# EAGLE design Stepper Driver (EAGLE 9.6.1)
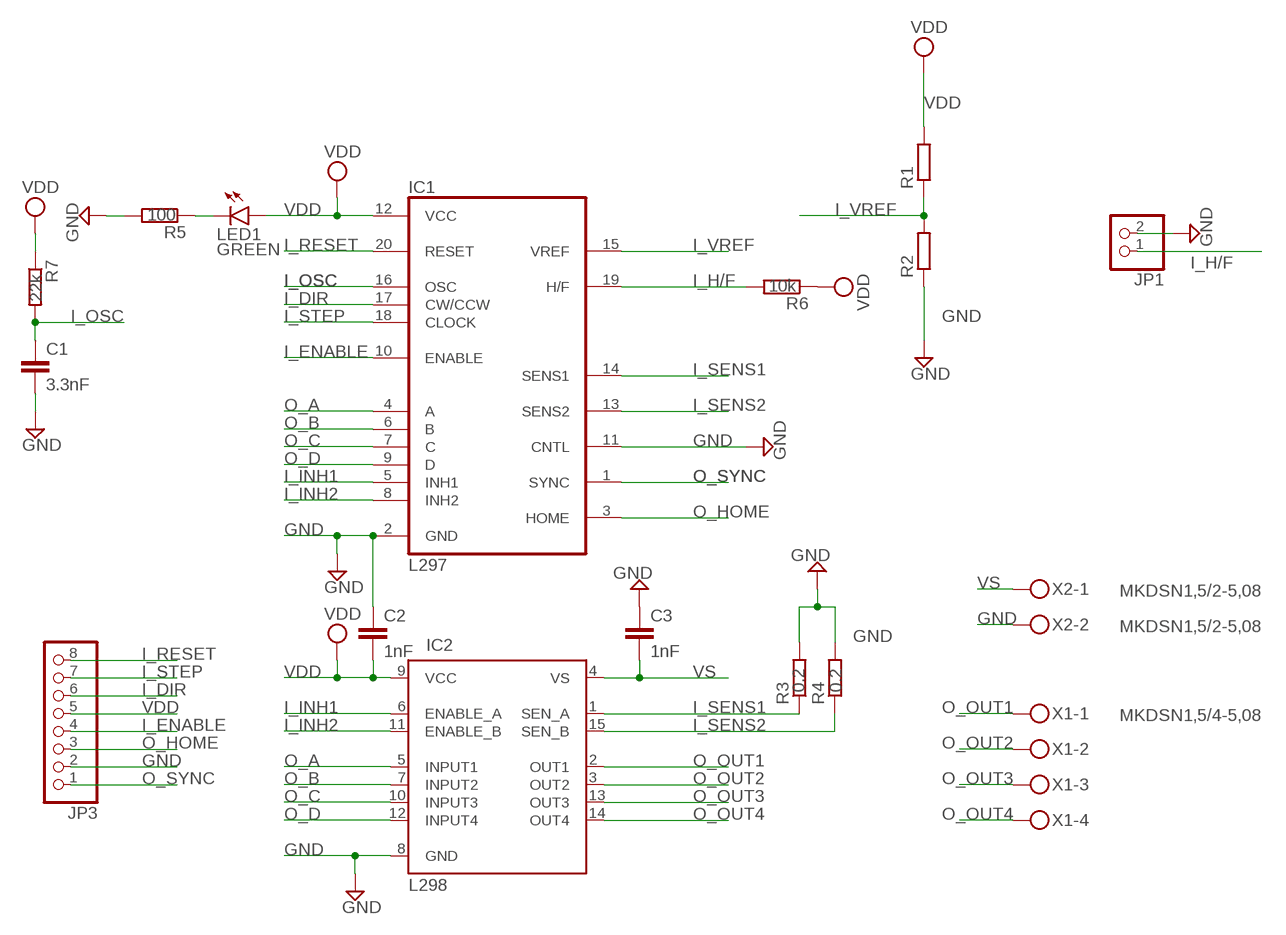
[diagram p0: schematic, sheet 1]

## Parts
C1  3.3nF  C-EUC0805K  [C0805K]
C2  1nF  C-EUC0805K  [C0805K]
C3  1nF  C-EUC0805K  [C0805K]
IC1  L297  [DIL20]
IC2  L298  [MULTIWATT-15]
JP1  PINHD-1X2  [1X02]
JP3  PINHD-1X8  [1X08]
LED1  GREEN  LED5MM  [LED5MM]
R1  R-EU_R0805  [R0805]
R2  R-EU_R0805  [R0805]
R3  0.2  R-EU_R2512  [R2512]
R4  0.2  R-EU_R2512  [R2512]
R5  100  R-EU_R0805  [R0805]
R6  10k  R-EU_R0805  [R0805]
R7  22k  R-EU_R0805  [R0805]
X1  MKDSN1,5/4-5,08  [MKDSN1,5/4-5,08]
X2  MKDSN1,5/2-5,08  [MKDSN1,5/2-5,08]

## Nets
GND: C1.2 C2.1 C3.1 IC1.2(GND) IC1.11(CNTL) IC2.8(GND) JP1.2 JP3.2 R2.1 R3.2 R4.2 R5.2 X2.2
I_DIR: IC1.17(CW/CCW) JP3.6
I_ENABLE: IC1.10(ENABLE) JP3.4
I_H/F: IC1.19(H/F) JP1.1 R6.2
I_INH1: IC1.5(INH1) IC2.6(ENABLE_A)
I_INH2: IC1.8(INH2) IC2.11(ENABLE_B)
I_OSC: C1.1 IC1.16(OSC) R7.2
I_RESET: IC1.20(RESET) JP3.8
I_SENS1: IC1.14(SENS1) IC2.1(SEN_A) R3.1
I_SENS2: IC1.13(SENS2) IC2.15(SEN_B) R4.1
I_STEP: IC1.18(CLOCK) JP3.7
I_VREF: IC1.15(VREF) R1.1 R2.2
N$1: LED1.K(C) R5.1
O_A: IC1.4(A) IC2.5(INPUT1)
O_B: IC1.6(B) IC2.7(INPUT2)
O_C: IC1.7(C) IC2.10(INPUT3)
O_D: IC1.9(D) IC2.12(INPUT4)
O_HOME: IC1.3(HOME) JP3.3
O_OUT1: IC2.2(OUT1) X1.1
O_OUT2: IC2.3(OUT2) X1.2
O_OUT3: IC2.13(OUT3) X1.3
O_OUT4: IC2.14(OUT4) X1.4
O_SYNC: IC1.1(SYNC) JP3.1
VDD: C2.2 IC1.12(VCC) IC2.9(VCC) JP3.5 LED1.A R1.2 R6.1 R7.1
VS: C3.2 IC2.4(VS) X2.1

## Library data of the parts
C1-C3 = rcl:C-EU: CAPACITOR, European symbol; SPICEPREFIX: C
IC1 = st-microelectronics:L297: STEPPER MOTOR CONTROLLER; MPN: L297/1; OC_FARNELL: 1094209; OC_NEWARK: 56P8258
IC2 = st-microelectronics:L298: DUAL FULL-BRIDGE DRIVER; MPN: L298N; OC_FARNELL: 1589425; OC_NEWARK: 32M1527
JP1 = pinhead:PINHD-1X2: PIN HEADER
JP3 = pinhead:PINHD-1X8: PIN HEADER
LED1 = led:LED: LED OSRAM: - CHIPLED LG R971, LG N971, LY N971, LG Q971, LY Q971, LO R971, LY R971 LH N974, LH R974 LS Q976, LO Q976, LY Q976 LO Q996 - Hyper CHIPLED LW Q18S LB Q993, LB Q99A, LB R99A - SideLED LS A670, LO A670, LY A670, LG A670, LP A670 LB A673, LV A673, LT A673, LW A673 LH A674 LY A675 LS A676, LA A676, LO A676, LY A676, LW A676 LS A679, LY A679, LG A679 - Hyper Micro SIDELED® LS Y876, LA Y876, LO Y876, LY Y876 LT Y87S - SmartLED LW L88C, LW L88S LB L89C, LB L89S, LG L890 LS L89K, LO L89K, LY L89K LS L896, LA L896, LO L896, LY L896 - TOPLED LS T670, LO T670, LY T670, LG T670, LP T670 LSG T670, LSP T670, LSY T670, LOP T670, LYG T670 LG T671, LOG T671, LSG T671 LB T673, LV T673, LT T673, LW T673 LH T674 LS T676, LA T676, LO T676, LY T676, LB T676, LH T676, LSB T676, LW T676 LB T67C, LV T67C, LT T67C, LS T67K, LO T67K, LY T67K, LW E67C LS E67B, LA E67B, LO E67B, LY E67B, LB E67C, LV E67C, LT E67C LW T67C LS T679, LY T679, LG T679 LS T770, LO T770, LY T770, LG T770, LP T770 LB T773, LV T773, LT T773, LW T773 LH T774 LS E675, LA E675, LY E675, LS T675 LS T776, LA T776, LO T776, LY T776, LB T776 LHGB T686 LT T68C, LB T68C - Hyper Mini TOPLED® LB M676 - Mini TOPLED Santana® LG M470 LS M47K, LO M47K, LY M47K Source: http://www.osram.convergy.de LUXEON: - LUMILED® LXK2-PW12-R00, LXK2-PW12-S00, LXK2-PW14-U00, LXK2-PW14-V00 LXK2-PM12-R00, LXK2-PM12-S00, LXK2-PM14-U00 LXK2-PE12-Q00, LXK2-PE12-R00, LXK2-PE12-S00, LXK2-PE14-T00, LXK2-PE14-U00 LXK2-PB12-K00, LXK2-PB12-L00, LXK2-PB12-M00, LXK2-PB14-N00, LXK2-PB14-P00, LXK2-PB14-Q00 LXK2-PR12-L00, LXK2-PR12-M00, LXK2-PR14-Q00, LXK2-PR14-R00 LXK2-PD12-Q00, LXK2-PD12-R00, LXK2-PD12-S00 LXK2-PH12-R00, LXK2-PH12-S00 LXK2-PL12-P00, LXK2-PL12-Q00, LXK2-PL12-R00 Source: www.luxeon.com KINGBRIGHT: KA-3528ASYC Source: www.kingbright.com
R1-R7 = rcl:R-EU_: RESISTOR, European symbol; SPICEPREFIX: R
X1 = con-phoenix-508:MKDSN1,5/4-5,08: MKDSN 1,5/ 4-5,08 Printklemme Nennstrom: 13,5 A Nennspannung: 250 V Rastermaß: 5,08 mm Polzahl: 4 Anschlussart: Schraubanschluss Montage: Löten Anschlussrichtung Leiter/Platine: 0 ° Artikelnummer: 1729144 Source: http://eshop.phoenixcontact.com .. 1729144.pdf
X2 = con-phoenix-508:MKDSN1,5/2-5,08: MKDSN 1,5/ 2-5,08 Printklemme Nennstrom: 13,5 A Nennspannung: 250 V Rastermaß: 5,08 mm Polzahl: 2 Anschlussart: Schraubanschluss Montage: Löten Anschlussrichtung Leiter/Platine: 0 ° Artikelnummer: 1729128 Source: http://eshop.phoenixcontact.com .. 1729128.pdf

## Board
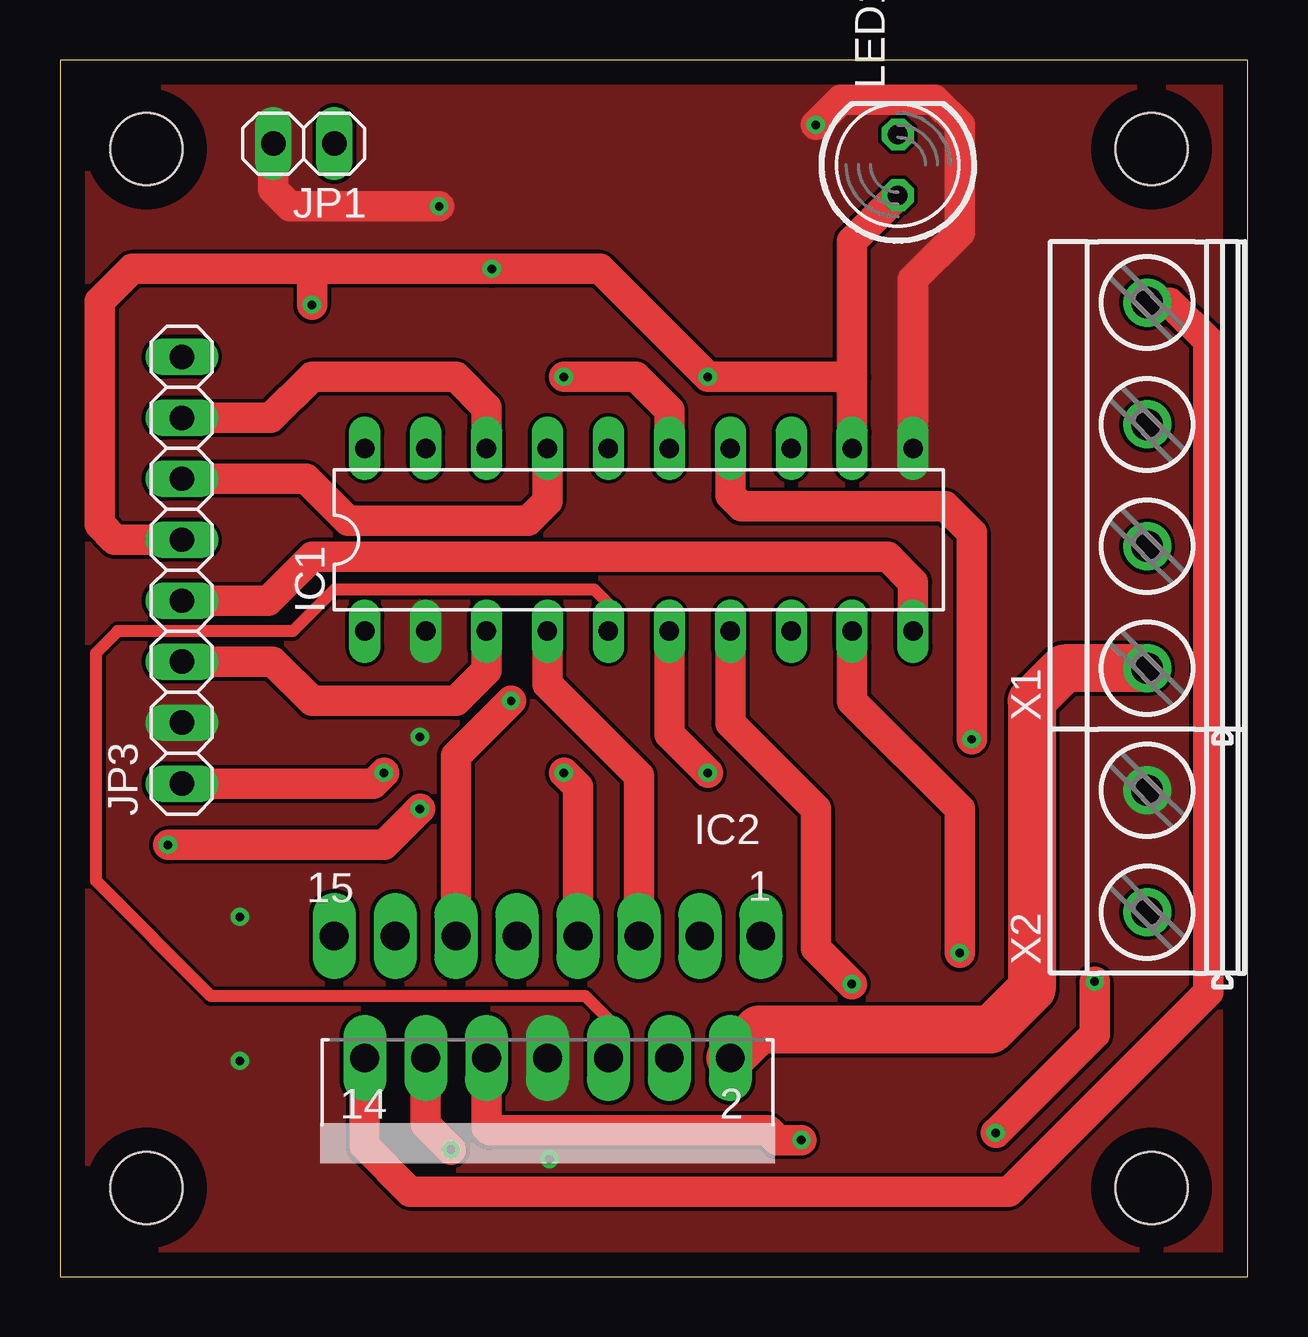
[diagram p1: board, top side]
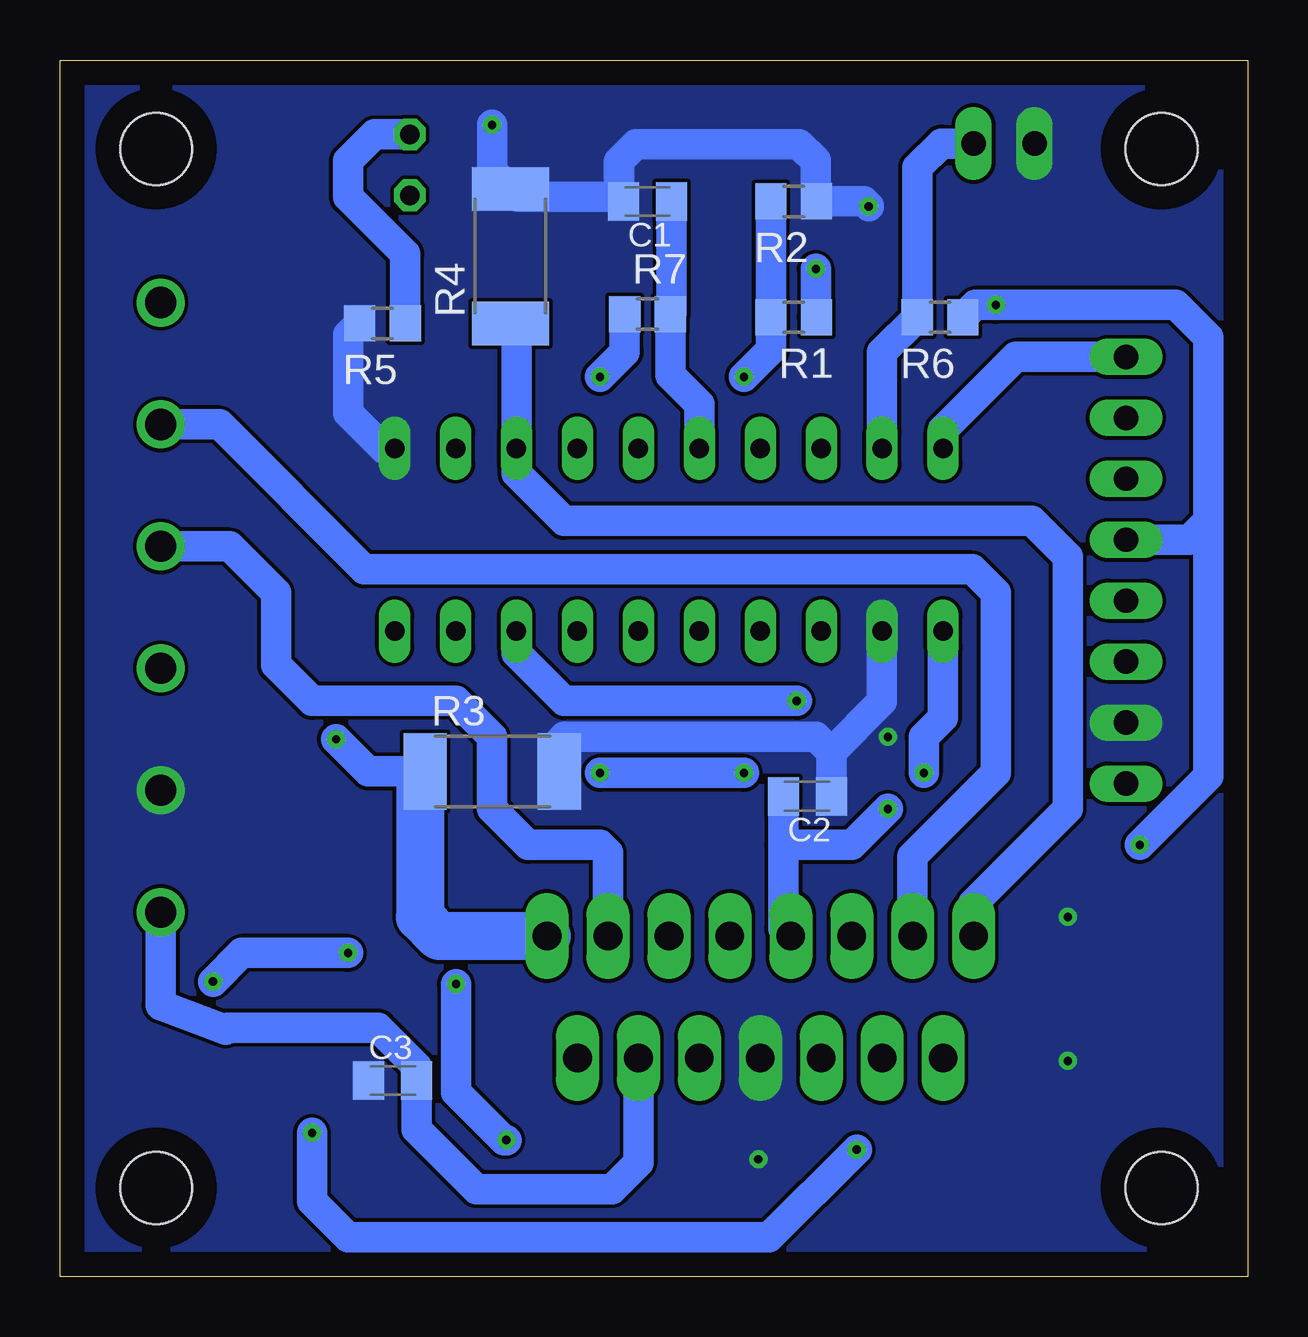
[diagram p2: board, bottom side, seen from below]

Size 49.51 x 50.7 mm. Coordinates in mm from the lower left corner, seen from the top.
Outline: 0,0 49.51,0 49.51,50.7 0,50.7 0,0
Copper layers (1*16): Top 0.035mm / dielectric 1.5mm / Bottom 0.035mm
Design rules "default": minimum track width 6mil, minimum drill 0.35mm, track to track 6mil, track to pad 6mil, pad to pad 6mil, via to via 6mil, smd to smd 6mil, copper to edge 40mil, drill to drill 6mil, minimum pad ring 10mil, minimum via ring 8mil, stop-mask expansion 4mil, vias tented up to drill 0mil, thermal gap 10mil
Holes 3 mm at 3.6,47 3.6,3.7 45.5,3.7 45.5,47

### Footprints (pad centres in the part's own frame; a part is rotated, then mirrored left to right if it is on the bottom)
C0805K = smd 1.3 x 1.6: 1 -1,0; 2 1,0
DIL20 = drill 0.813 long: 1 -11.43,-3.81; 2 -8.89,-3.81; 3 -6.35,-3.81; 4 -3.81,-3.81; 5 -1.27,-3.81; 6 1.27,-3.81; 7 3.81,-3.81; 8 6.35,-3.81; 9 8.89,-3.81; 10 11.43,-3.81; 11 11.43,3.81; 12 8.89,3.81; 13 6.35,3.81; 14 3.81,3.81; 15 1.27,3.81; 16 -1.27,3.81; 17 -3.81,3.81; 18 -6.35,3.81; 19 -8.89,3.81; 20 -11.43,3.81
MULTIWATT-15 = drill 1.2 long: 1 -8.89,-7.62; 2 -7.62,-2.54; 3 -6.35,-7.62; 4 -5.08,-2.54; 5 -3.81,-7.62; 6 -2.54,-2.54; 7 -1.27,-7.62; 8 0,-2.54; 9 1.27,-7.62; 10 2.54,-2.54; 11 3.81,-7.62; 12 5.08,-2.54; 13 6.35,-7.62; 14 7.62,-2.54; 15 8.89,-7.62
1X02 = drill 1.016 long: 1 -1.27,0; 2 1.27,0
1X08 = drill 1.016 long: 1 -8.89,0; 2 -6.35,0; 3 -3.81,0; 4 -1.27,0; 5 1.27,0; 6 3.81,0; 7 6.35,0; 8 8.89,0
LED5MM = drill 0.813 octagon: A -1.27,0; K 1.27,0
R0805 = smd 1.3 x 1.5: 1 -0.95,0; 2 0.95,0
R2512 = smd 1.8 x 3.2: 1 -2.8,0; 2 2.8,0
MKDSN1,5/4-5,08 = drill 1.3 pad 2: 1 -7.641,0.025; 2 -2.561,0.025; 3 2.519,0.025; 4 7.599,0.025
MKDSN1,5/2-5,08 = drill 1.3 pad 2: 1 -2.561,0.025; 2 2.519,0.025

### Placement (x,y rotation side)
C1  25.02,44.81 180 bottom
C2  18.36,20.02 180 bottom
C3  35.64,8.18 0 bottom
IC1  24.13,30.71 0 top
IC2  20.32,6.58 180 top
JP1  10.16,47.22 180 top
JP3  5.08,29.44 90 top
LED1  34.92,46.33 90 top
R1  18.92,39.98 0 bottom
R2  18.92,44.81 180 bottom
R3  31.5,21.06 0 bottom
R4  30.73,42.52 90 bottom
R5  36.07,39.73 180 bottom
R6  12.83,39.98 180 bottom
R7  25.02,40.11 0 bottom
X1  45.34,33 90 top
X2  45.34,17.76 90 top

### Tracks (layer width: path | path; a pad name or v marks a point on that pad's centre or on a via)
GND  (via drill 0.35)
  Top 1.27: JP1.2 8.89,45.31 9.6,44.6 v15.8,44.6 | IC1.11 35.56,41.56 37.5,43.5 37.5,48 36.45,49.05 32.55,49.05 v31.5,48
  Bottom 1.27: C1.2 26.21,45 | 26.21,45 30.41,45 R4.2 31.5,46.09 v31.5,48 | R5.2 37.5,39.24 37.5,36 36,34.5 35.58,34.5 IC1.11 | C2.1 17.36,21.86 | 17.36,21.86 18,22.5 28.5,22.5 28.7,22.3 R3.2 | 17.36,21.86 15.24,23.98 IC1.2 | v15.8,44.6 16.01,44.81 R2.1 18,44.83 18,46.5 18.7,47.2 25.5,47.2 26.21,46.49 26.21,45
  other vias: 15,22.5 7.5,15 7.5,9 20.4,4.9
  pour Bottom (no thermals): 0,51 49.5,51 49.5,0 0,0
  pour Top (no thermals): 0,51 49.5,51 49.5,0 0,0
I_DIR
  Top 1.27: IC1.17 20.32,32.32 19.5,31.5 12,31.5 10.25,33.25 JP3.6
I_ENABLE
  Top 1.27: JP3.4 8.67,28.17 10.5,30 34.5,30 35.56,28.94 IC1.10
I_H/F
  Bottom 1.27: IC1.19 15.24,38.52 R6.2 13.78,46.22 12.78,47.22 JP1.1
I_INH1
  Top 0.508: IC2.6 22.86,10.74 21.9,11.7 6.3,11.7 1.5,16.5 1.5,26 2.4,26.9 9.7,26.9 11.43,28.63 22.27,28.63 22.86,28.04 IC1.5
I_INH2  (via drill 0.35)
  Top 1.27: v18.8,24 16.51,21.71 IC2.11
  Bottom 1.27: v18.8,24 28.5,24 30.48,25.98 IC1.8
I_OSC
  Bottom 1.27: C1.1 24.02,40.16 R7.2 24.07,37.57 22.86,36.36 IC1.16
I_RESET
  Bottom 1.27: JP3.8 9.67,38.33 12.7,35.3 IC1.20
I_SENS1  (via drill 0.35)
  Top 1.27: IC1.14 27.94,32.56 28.4,32.1 36.9,32.1 38,31 v38,22.4
  Bottom 0.305: R3.1 34.35,21 34.5,21
  Bottom 1.27: v38,22.4 36.66,21.06 R3.1
  Bottom 2: IC2.1 33.7,14.2 34.5,15 34.5,21
I_SENS2
  Bottom 1.27: R4.1 30.48,39.47 IC1.13 30.48,33.48 28.5,31.5 9,31.5 7.5,30 7.5,19.5 11.43,15.57 IC2.15
I_STEP
  Top 1.27: JP3.7 8.79,35.79 10.5,37.5 16.5,37.5 17.78,36.22 IC1.18
I_VREF  (via drill 0.35)
  Top 1.27: IC1.15 25.4,36.1 24,37.5 v21,37.5
  Bottom 1.27: R2.2 R1.1 19.87,38.63 v21,37.5
N$1
  Bottom 1.27: R5.1 35.12,42.62 37.5,45 37.5,46.5 36.4,47.6 LED1.K
O_A
  Top 1.27: IC2.5 24.13,20.87 20.32,24.68 IC1.4
O_B  (via drill 0.35)
  Top 1.27: IC2.7 21.59,20.41 v21,21 | v27,21 25.4,22.6 IC1.6
  Bottom 1.27: v21,21 v27,21
O_C  (via drill 0.35)
  Top 1.27: IC1.7 27.94,23.06 31.5,19.5 31.5,13.7 v33,12.2 | v30.9,5.7 29.9,5.7 29.5,6.1 17.9,6.1 17.78,6.22 IC2.10
  Bottom 1.27: v33,12.2 33,7.7 31,5.7 v30.9,5.7
O_D  (via drill 0.35)
  Top 1.27: IC1.9 33.02,23.98 37.5,19.5 v37.5,13.5 | IC2.12 15.24,6.36 v16.3,5.3 | v39,6 39.03,6 43.13,10.1 v43.13,12.3
  Bottom 1.27: v37.5,13.5 41.93,13.5 v43.13,12.3 | v16.3,5.3 19.95,1.65 37.5,1.65 39,3.15 v39,6
O_HOME
  Top 1.27: JP3.3 8.87,25.63 10.5,24 16.5,24 17.78,25.28 IC1.3
O_OUT1
  Top 2: X1.1 41.85,25.36 40.5,24 40.5,12 38.8,10.3 29.12,10.3 IC2.2
O_OUT2
  Bottom 1.27: IC2.3 26.67,17.67 27,18 30,18 31.5,19.5 31.5,22.5 33,24 39,24 40.5,25.5 40.5,28.5 42.44,30.43 X1.2
O_OUT3
  Bottom 1.27: IC2.13 13.97,17.53 10.5,21 10.5,28.5 11.48,29.48 36.83,29.48 42.86,35.52 X1.3
O_OUT4
  Top 1.27: IC2.14 12.7,5.45 14.6,3.55 39.55,3.55 47.86,11.86 47.86,39 46.26,40.59 X1.4
O_SYNC  (via drill 0.35)
  Top 1.27: JP3.1 13.05,20.55 v13.5,21
  Bottom 1.27: v13.5,21 13.5,22.5 12.7,23.3 IC1.1
VDD  (via drill 0.35)
  Top 1.27: LED1.A 33.02,43.16 33.02,37.5 | IC1.12 33.02,37.5 | 33.02,37.5 v27,37.5 22.5,42 v18,42 10.5,42 | 10.5,42 3,42 1.65,40.65 1.65,31.35 2.29,30.71 JP3.5 | 10.5,42 v10.5,40.5 | v15,19.5 13.5,18 v4.5,18
  Bottom 1.27: C2.2 19.36,18 | 19.36,18 19.36,14.51 IC2.9 | JP3.5 2.44,30.71 1.65,31.5 | R6.1 11.36,40.5 v10.5,40.5 3,40.5 1.65,39.15 1.65,31.5 | v27,37.5 25.97,38.53 R7.1 | v18,42 18,40.01 R1.2 | 19.36,18 16.5,18 v15,19.5 | v4.5,18 1.65,20.85 1.65,31.5
VS
  Bottom 1.27: IC2.4 25.4,4.75 26.5,3.65 32.15,3.65 34.64,6.14 C3.2 34.64,8.78 36.24,10.38 42.52,10.38 42.6,10.3 45.31,11.32 X2.1